# Altium project ATMega328_Mini.PrjPCB
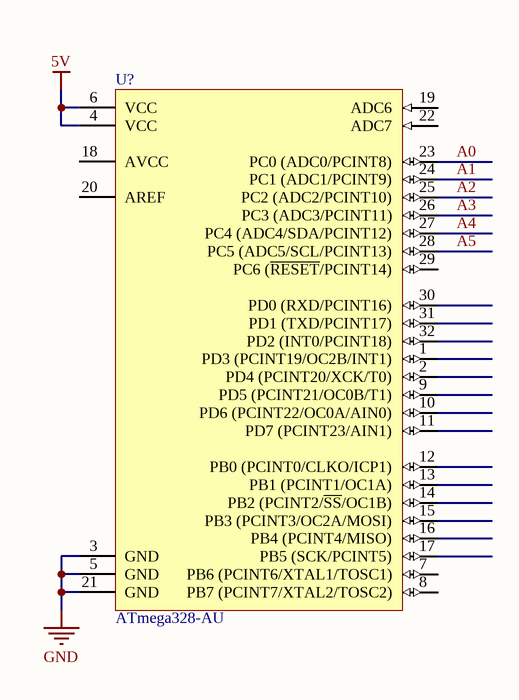
[diagram p0: ATMega328_Mini.SchDoc]
1 sheet, 1 parts. Net scope: global (net labels, ports and power ports of the same name join across sheets).
Board file: ATMega328_Mini.PcbDoc

## Sheet ATMega328_Mini.SchDoc
size A4

### Parts
U?  ATmega328-AU  [32A_N]

### Nets
5V: U?.4(VCC) U?.6(VCC)
GND: U?.3(GND) U?.5(GND) U?.21(GND)
A0: U?.23(PC0_(ADC0/PCINT8))
A1: U?.24(PC1_(ADC1/PCINT9))
A2: U?.25(PC2_(ADC2/PCINT10))
A3: U?.26(PC3_(ADC3/PCINT11))
A4: U?.27(PC4_(ADC4/SDA/PCINT12))
A5: U?.28(PC5_(ADC5/SCL/PCINT13))

Not connected (* = marked no-connect by the designer): U? 1(PD3_(PCINT19/OC2B/INT1)) 2(PD4_(PCINT20/XCK/T0)) 7(PB6_(PCINT6/XTAL1/TOSC1)) 8(PB7_(PCINT7/XTAL2/TOSC2)) 9(PD5_(PCINT21/OC0B/T1)) 10(PD6_(PCINT22/OC0A/AIN0)) 11(PD7_(PCINT23/AIN1)) 12(PB0_(PCINT0/CLKO/ICP1)) 13(PB1_(PCINT1/OC1A)) 14(PB2_(PCINT2/~{SS}/OC1B)) 15(PB3_(PCINT3/OC2A/MOSI)) 16(PB4_(PCINT4/MISO)) 17(PB5_(SCK/PCINT5)) 18(AVCC) 19(ADC6) 20(AREF) 22(ADC7) 29(PC6_(~{RESET}/PCINT14)) 30(PD0_(RXD/PCINT16)) 31(PD1_(TXD/PCINT17)) 32(PD2_(INT0/PCINT18))

### Library data of the parts
U? = ATmega328-AU: 8-bit AVR Microcontroller, 32KB Flash, 1KB EEPROM, 2KB SRAM, 32-pin TQFP, Industrial Grade (-40°C to 85°C); Published: 1-Apr-2010; DatasheetVersion: revA, Jan-2010; PackageVersion: revB, Oct-2001; PackageReference: 32A; Publisher: Altium Limited; PackageDescription: 32-Lead, 7x7x1.0 mm Body, 0.8mm Lead Pitch, Thin Profile Plastic Quad Flat Package (TQFP); Supplier 1: Digi-Key; Supplier Part Number 1: ATMEGA328-AU-ND; Supplier 2: Mouser; Supplier Part Number 2: 556-ATMEGA328-AU; Code_JEDEC: MS-026-ABA; ComponentLink1Description: Manufacturer Link; ComponentLink1URL: http://www.atmel.com/products/avr/default.asp?; ComponentLink2Description: ATmega48A/48PA/88A/88PA/168A/168PA/328/328P Datasheet; ComponentLink2URL: http://www.atmel.com/dyn/resources/prod_documents/8271.pdf; ComponentLink3Description: ATmega48A/48PA/88A/88PA/168A/168PA/328/328P Summary; ComponentLink3URL: http://www.atmel.com/dyn/resources/prod_documents/8271S.pdf; ComponentLink4Description: Atmel.com Home; ComponentLink4URL: http://www.atmel.com